# Altium schematic sheet sntrler.SchDoc: Scalony Skaner Bioimpedancji
size A4; DrawnBy: Łukasz Przeniosło; Organization: Zachodniopomorski; Address1: Uniwersytet Technologiczny; Address2: w Szczecinie; Address3: Wydział Elektryczny; Address4: Katedra KISSE; Revision: 1.0; SheetNumber: 1; SheetTotal: 7
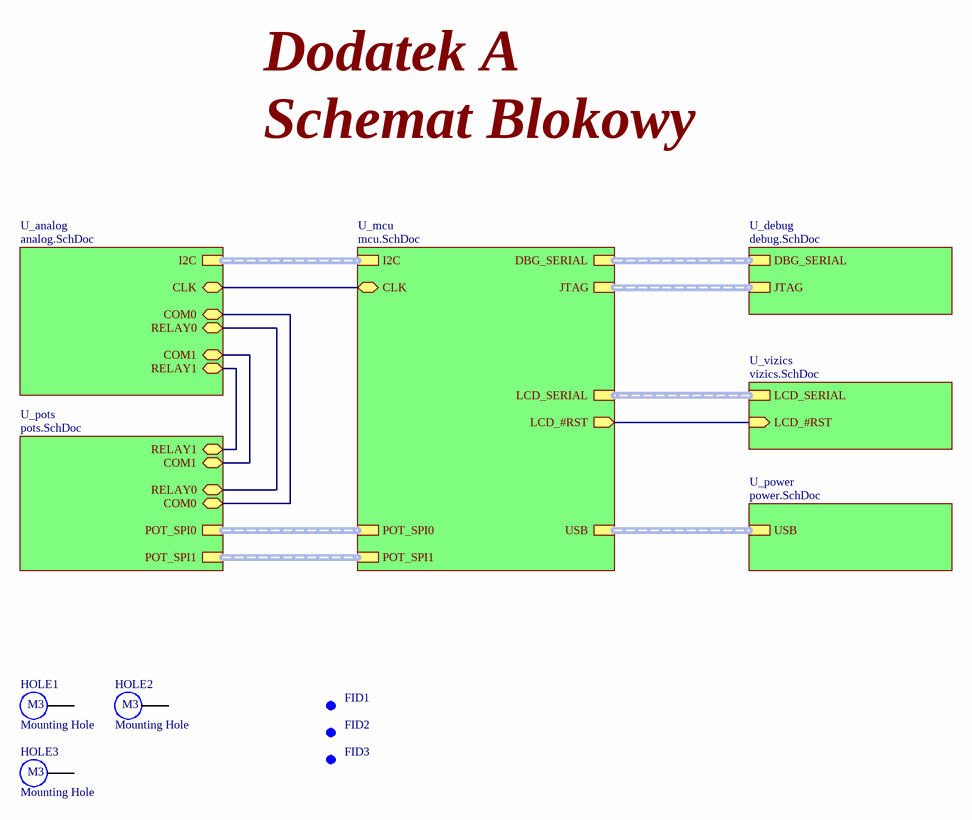
[diagram p0: sntrler.SchDoc]

## Parts
FID1  Fiducial  [Fid Round]  (value not drawn)  (no BOM)
FID2  Fiducial  [Fid Round]  (value not drawn)  (no BOM)
FID3  Fiducial  [Fid Round]  (value not drawn)  (no BOM)
HOLE1  Mounting Hole  [Hole3.2x6mm]  (no BOM)
HOLE2  Mounting Hole  [Hole3.2x6mm]  (no BOM)
HOLE3  Mounting Hole  [Hole3.2x6mm]  (no BOM)

## Sub-sheets
U_analog = analog.SchDoc: I2C (harness I2C), COM0 (bidir), RELAY0 (bidir), COM1 (bidir), RELAY1 (bidir), CLK (bidir)
U_debug = debug.SchDoc: DBG_SERIAL (harness DBG_SERIAL), JTAG (harness JTAG)
U_mcu = mcu.SchDoc: JTAG (harness JTAG), LCD_SERIAL (harness LCD_SERIAL), I2C (harness I2C), DBG_SERIAL (harness DBG_SERIAL), POT_SPI0 (harness POT_SPI0), USB (harness USB), LCD_#RST (out), POT_SPI1 (harness POT_SPI1), CLK (bidir)
U_pots = pots.SchDoc: POT_SPI0 (harness POT_SPI0), POT_SPI1 (harness POT_SPI1), COM0 (bidir), RELAY0 (bidir), COM1 (bidir), RELAY1 (bidir)
U_power = power.SchDoc: USB (harness USB)
U_vizics = vizics.SchDoc: LCD_SERIAL (harness LCD_SERIAL), LCD_#RST (in)

## Nets
(unnamed): sheet U_analog/COM0, sheet U_pots/COM0
(unnamed): sheet U_analog/RELAY0, sheet U_pots/RELAY0
(unnamed): sheet U_analog/COM1, sheet U_pots/COM1
(unnamed): sheet U_analog/RELAY1, sheet U_pots/RELAY1
(unnamed): sheet U_analog/CLK, sheet U_mcu/CLK
(unnamed): sheet U_mcu/LCD_#RST, sheet U_vizics/LCD_#RST

Not connected (* = marked no-connect by the designer): HOLE1 0; HOLE2 0; HOLE3 0

## Buses and harness runs
harness sheet U_analog/I2C = sheet U_mcu/I2C
harness sheet U_debug/DBG_SERIAL = sheet U_mcu/DBG_SERIAL
harness sheet U_debug/JTAG = sheet U_mcu/JTAG
harness sheet U_mcu/LCD_SERIAL = sheet U_vizics/LCD_SERIAL
harness sheet U_mcu/POT_SPI0 = sheet U_pots/POT_SPI0
harness sheet U_mcu/POT_SPI1 = sheet U_pots/POT_SPI1
harness sheet U_mcu/USB = sheet U_power/USB

## Notes on the sheet
- Dodatek A
- Schemat Blokowy
- Title
- Size:
- Date:
- A4
- Author:
- Time:
- Sheet
- of
- File:
- (in symbol HOLE M3) M3

## Library data of the parts
FID1-FID3 = FID ROUND: round fiducial
HOLE1-HOLE3 = HOLE M3